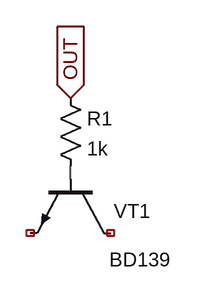
[diagram p0: schematic key.asc]
key.asc, the LTspice schematic file:
Version 4
SHEET 1 880 680
WIRE -32 192 -32 176
FLAG -32 96 OUT
IOPIN -32 96 In
SYMBOL npn 16 192 R90
WINDOW 0 38 -48 VRight 2
WINDOW 3 96 -72 VRight 2
SYMATTR InstName VT1
SYMATTR Value BD139
SYMBOL res -48 80 R0
SYMATTR InstName R1
SYMATTR Value 1k

The netlist it stands for:
* key.asc
Q§VT1 NC_01 N001 NC_02 0 BD139
R1 OUT N001 1k
.model NPN NPN
.model PNP PNP
.lib standard.bjt
.backanno
.end